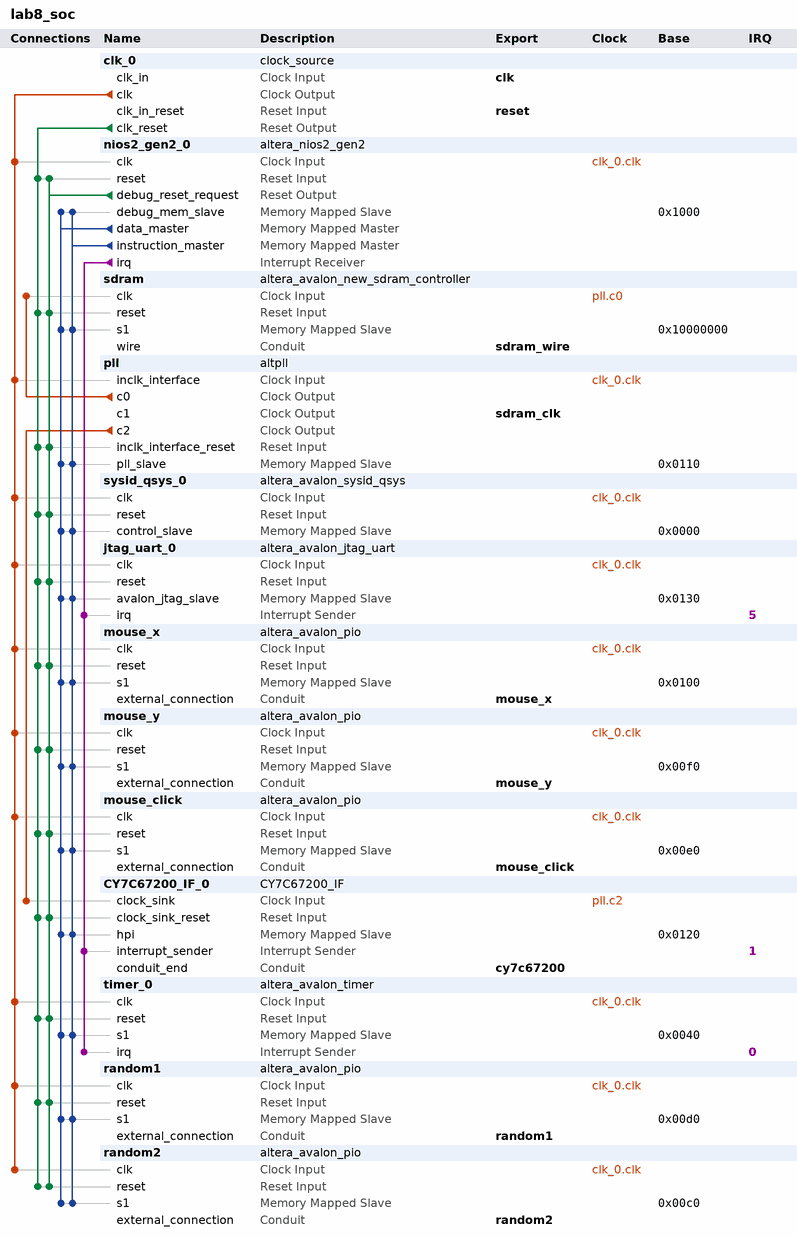
[diagram p0: system contents]
# Platform Designer (Qsys) system lab8_soc, Cyclone IV E EP4CE115F29C7
# Parameters at their usual value, and those the tool derives, are not listed.
package require -exact qsys 18.1
create_system lab8_soc
set_project_property DEVICE_FAMILY {Cyclone IV E}
set_project_property DEVICE EP4CE115F29C7

add_instance clk_0 clock_source 18.1
set_instance_parameter_value clk_0 clockFrequency 50000000

add_instance nios2_gen2_0 altera_nios2_gen2 18.1
set_instance_parameter_value nios2_gen2_0 dcache_size 2048
set_instance_parameter_value nios2_gen2_0 exceptionSlave sdram.s1
set_instance_parameter_value nios2_gen2_0 icache_size 4096
set_instance_parameter_value nios2_gen2_0 impl Tiny
set_instance_parameter_value nios2_gen2_0 resetSlave sdram.s1

add_instance sdram altera_avalon_new_sdram_controller 18.1
set_instance_parameter_value sdram TAC 5.5
set_instance_parameter_value sdram TRCD 20.0
set_instance_parameter_value sdram TRP 20.0
set_instance_parameter_value sdram casLatency 3
set_instance_parameter_value sdram columnWidth 10
set_instance_parameter_value sdram dataWidth 32
set_instance_parameter_value sdram generateSimulationModel false
set_instance_parameter_value sdram model single_Micron_MT48LC4M32B2_7_chip
set_instance_parameter_value sdram numberOfBanks 4
set_instance_parameter_value sdram numberOfChipSelects 1
set_instance_parameter_value sdram powerUpDelay 200.0
set_instance_parameter_value sdram refreshPeriod 7.8125
set_instance_parameter_value sdram rowWidth 13

add_instance pll altpll 18.1
set_instance_parameter_value pll CLK0_DIVIDE_BY 1
set_instance_parameter_value pll CLK0_MULTIPLY_BY 1
set_instance_parameter_value pll CLK1_DIVIDE_BY 1
set_instance_parameter_value pll CLK1_DUTY_CYCLE 50
set_instance_parameter_value pll CLK1_MULTIPLY_BY 1
set_instance_parameter_value pll CLK1_PHASE_SHIFT -3000
set_instance_parameter_value pll CLK2_DIVIDE_BY 5
set_instance_parameter_value pll CLK2_DUTY_CYCLE 50
set_instance_parameter_value pll CLK2_MULTIPLY_BY 1
set_instance_parameter_value pll CLK2_PHASE_SHIFT 0
set_instance_parameter_value pll INCLK0_INPUT_FREQUENCY 20000
set_instance_parameter_value pll PORT_ARESET PORT_UNUSED
set_instance_parameter_value pll PORT_LOCKED PORT_UNUSED
set_instance_parameter_value pll PORT_clk1 PORT_USED
set_instance_parameter_value pll PORT_clk2 PORT_USED
set_instance_parameter_value pll PORT_clk3 PORT_UNUSED

add_instance sysid_qsys_0 altera_avalon_sysid_qsys 18.1
set_instance_parameter_value sysid_qsys_0 id 0

add_instance jtag_uart_0 altera_avalon_jtag_uart 18.1
set_instance_parameter_value jtag_uart_0 simInteractiveOptions NO_INTERACTIVE_WINDOWS

add_instance mouse_x altera_avalon_pio 18.1
set_instance_parameter_value mouse_x direction Output
set_instance_parameter_value mouse_x width 16

add_instance mouse_y altera_avalon_pio 18.1
set_instance_parameter_value mouse_y direction Output
set_instance_parameter_value mouse_y width 16

add_instance mouse_click altera_avalon_pio 18.1
set_instance_parameter_value mouse_click direction Output
set_instance_parameter_value mouse_click width 8

add_instance CY7C67200_IF_0 CY7C67200_IF 1.0

add_instance timer_0 altera_avalon_timer 18.1
set_instance_parameter_value timer_0 period 1
set_instance_parameter_value timer_0 periodUnits MSEC

add_instance random1 altera_avalon_pio 18.1
set_instance_parameter_value random1 direction Output
set_instance_parameter_value random1 width 4

add_instance random2 altera_avalon_pio 18.1
set_instance_parameter_value random2 direction Output
set_instance_parameter_value random2 width 4

# connections
add_connection clk_0.clk jtag_uart_0.clk clock
add_connection clk_0.clk mouse_click.clk clock
add_connection clk_0.clk mouse_x.clk clock
add_connection clk_0.clk mouse_y.clk clock
add_connection clk_0.clk nios2_gen2_0.clk clock
add_connection clk_0.clk pll.inclk_interface clock
add_connection clk_0.clk random1.clk clock
add_connection clk_0.clk random2.clk clock
add_connection clk_0.clk sysid_qsys_0.clk clock
add_connection clk_0.clk timer_0.clk clock
add_connection pll.c0 sdram.clk clock
add_connection pll.c2 CY7C67200_IF_0.clock_sink clock
add_connection clk_0.clk_reset CY7C67200_IF_0.clock_sink_reset reset
add_connection clk_0.clk_reset jtag_uart_0.reset reset
add_connection clk_0.clk_reset mouse_click.reset reset
add_connection clk_0.clk_reset mouse_x.reset reset
add_connection clk_0.clk_reset mouse_y.reset reset
add_connection clk_0.clk_reset nios2_gen2_0.reset reset
add_connection clk_0.clk_reset pll.inclk_interface_reset reset
add_connection clk_0.clk_reset random1.reset reset
add_connection clk_0.clk_reset random2.reset reset
add_connection clk_0.clk_reset sdram.reset reset
add_connection clk_0.clk_reset sysid_qsys_0.reset reset
add_connection clk_0.clk_reset timer_0.reset reset
add_connection nios2_gen2_0.debug_reset_request CY7C67200_IF_0.clock_sink_reset reset
add_connection nios2_gen2_0.debug_reset_request jtag_uart_0.reset reset
add_connection nios2_gen2_0.debug_reset_request mouse_click.reset reset
add_connection nios2_gen2_0.debug_reset_request mouse_x.reset reset
add_connection nios2_gen2_0.debug_reset_request mouse_y.reset reset
add_connection nios2_gen2_0.debug_reset_request nios2_gen2_0.reset reset
add_connection nios2_gen2_0.debug_reset_request pll.inclk_interface_reset reset
add_connection nios2_gen2_0.debug_reset_request random1.reset reset
add_connection nios2_gen2_0.debug_reset_request random2.reset reset
add_connection nios2_gen2_0.debug_reset_request sdram.reset reset
add_connection nios2_gen2_0.debug_reset_request sysid_qsys_0.reset reset
add_connection nios2_gen2_0.debug_reset_request timer_0.reset reset
add_connection nios2_gen2_0.data_master CY7C67200_IF_0.hpi avalon
set_connection_parameter_value nios2_gen2_0.data_master/CY7C67200_IF_0.hpi baseAddress 0x0120
add_connection nios2_gen2_0.data_master jtag_uart_0.avalon_jtag_slave avalon
set_connection_parameter_value nios2_gen2_0.data_master/jtag_uart_0.avalon_jtag_slave baseAddress 0x0130
add_connection nios2_gen2_0.data_master mouse_click.s1 avalon
set_connection_parameter_value nios2_gen2_0.data_master/mouse_click.s1 baseAddress 0x00e0
add_connection nios2_gen2_0.data_master mouse_x.s1 avalon
set_connection_parameter_value nios2_gen2_0.data_master/mouse_x.s1 baseAddress 0x0100
add_connection nios2_gen2_0.data_master mouse_y.s1 avalon
set_connection_parameter_value nios2_gen2_0.data_master/mouse_y.s1 baseAddress 0x00f0
add_connection nios2_gen2_0.data_master nios2_gen2_0.debug_mem_slave avalon
set_connection_parameter_value nios2_gen2_0.data_master/nios2_gen2_0.debug_mem_slave baseAddress 0x1000
add_connection nios2_gen2_0.data_master pll.pll_slave avalon
set_connection_parameter_value nios2_gen2_0.data_master/pll.pll_slave baseAddress 0x0110
add_connection nios2_gen2_0.data_master random1.s1 avalon
set_connection_parameter_value nios2_gen2_0.data_master/random1.s1 baseAddress 0x00d0
add_connection nios2_gen2_0.data_master random2.s1 avalon
set_connection_parameter_value nios2_gen2_0.data_master/random2.s1 baseAddress 0x00c0
add_connection nios2_gen2_0.data_master sdram.s1 avalon
set_connection_parameter_value nios2_gen2_0.data_master/sdram.s1 baseAddress 0x10000000
add_connection nios2_gen2_0.data_master sysid_qsys_0.control_slave avalon
set_connection_parameter_value nios2_gen2_0.data_master/sysid_qsys_0.control_slave baseAddress 0x0000
add_connection nios2_gen2_0.data_master timer_0.s1 avalon
set_connection_parameter_value nios2_gen2_0.data_master/timer_0.s1 baseAddress 0x0040
add_connection nios2_gen2_0.instruction_master CY7C67200_IF_0.hpi avalon
set_connection_parameter_value nios2_gen2_0.instruction_master/CY7C67200_IF_0.hpi baseAddress 0x0120
add_connection nios2_gen2_0.instruction_master jtag_uart_0.avalon_jtag_slave avalon
set_connection_parameter_value nios2_gen2_0.instruction_master/jtag_uart_0.avalon_jtag_slave baseAddress 0x0130
add_connection nios2_gen2_0.instruction_master mouse_click.s1 avalon
set_connection_parameter_value nios2_gen2_0.instruction_master/mouse_click.s1 baseAddress 0x00e0
add_connection nios2_gen2_0.instruction_master mouse_x.s1 avalon
set_connection_parameter_value nios2_gen2_0.instruction_master/mouse_x.s1 baseAddress 0x0100
add_connection nios2_gen2_0.instruction_master mouse_y.s1 avalon
set_connection_parameter_value nios2_gen2_0.instruction_master/mouse_y.s1 baseAddress 0x00f0
add_connection nios2_gen2_0.instruction_master nios2_gen2_0.debug_mem_slave avalon
set_connection_parameter_value nios2_gen2_0.instruction_master/nios2_gen2_0.debug_mem_slave baseAddress 0x1000
add_connection nios2_gen2_0.instruction_master pll.pll_slave avalon
set_connection_parameter_value nios2_gen2_0.instruction_master/pll.pll_slave baseAddress 0x0110
add_connection nios2_gen2_0.instruction_master random1.s1 avalon
set_connection_parameter_value nios2_gen2_0.instruction_master/random1.s1 baseAddress 0x00d0
add_connection nios2_gen2_0.instruction_master random2.s1 avalon
set_connection_parameter_value nios2_gen2_0.instruction_master/random2.s1 baseAddress 0x00c0
add_connection nios2_gen2_0.instruction_master sdram.s1 avalon
set_connection_parameter_value nios2_gen2_0.instruction_master/sdram.s1 baseAddress 0x10000000
add_connection nios2_gen2_0.instruction_master sysid_qsys_0.control_slave avalon
set_connection_parameter_value nios2_gen2_0.instruction_master/sysid_qsys_0.control_slave baseAddress 0x0000
add_connection nios2_gen2_0.instruction_master timer_0.s1 avalon
set_connection_parameter_value nios2_gen2_0.instruction_master/timer_0.s1 baseAddress 0x0040
add_connection nios2_gen2_0.irq CY7C67200_IF_0.interrupt_sender interrupt
set_connection_parameter_value nios2_gen2_0.irq/CY7C67200_IF_0.interrupt_sender irqNumber 1
add_connection nios2_gen2_0.irq jtag_uart_0.irq interrupt
set_connection_parameter_value nios2_gen2_0.irq/jtag_uart_0.irq irqNumber 5
add_connection nios2_gen2_0.irq timer_0.irq interrupt
set_connection_parameter_value nios2_gen2_0.irq/timer_0.irq irqNumber 0

# exported interfaces
add_interface clk clock sink
set_interface_property clk EXPORT_OF clk_0.clk_in
add_interface cy7c67200 conduit end
set_interface_property cy7c67200 EXPORT_OF CY7C67200_IF_0.conduit_end
add_interface mouse_click conduit end
set_interface_property mouse_click EXPORT_OF mouse_click.external_connection
add_interface mouse_x conduit end
set_interface_property mouse_x EXPORT_OF mouse_x.external_connection
add_interface mouse_y conduit end
set_interface_property mouse_y EXPORT_OF mouse_y.external_connection
add_interface random1 conduit end
set_interface_property random1 EXPORT_OF random1.external_connection
add_interface random2 conduit end
set_interface_property random2 EXPORT_OF random2.external_connection
add_interface reset reset sink
set_interface_property reset EXPORT_OF clk_0.clk_in_reset
add_interface sdram_clk clock source
set_interface_property sdram_clk EXPORT_OF pll.c1
add_interface sdram_wire conduit end
set_interface_property sdram_wire EXPORT_OF sdram.wire

set_interconnect_requirement {$system} qsys_mm.clockCrossingAdapter HANDSHAKE
set_interconnect_requirement {$system} qsys_mm.enableEccProtection FALSE
set_interconnect_requirement {$system} qsys_mm.insertDefaultSlave FALSE
set_interconnect_requirement {$system} qsys_mm.maxAdditionalLatency 1

save_system lab8_soc.qsys
